# Altium schematic sheet USB_TypeC_DRP.SchDoc: USB Type-C DRP
size A3; DocumentNumber: 13; Revision: A-01; SheetNumber: 13; SheetTotal: 17; Project: STM32MP15-BATTERY BOARD
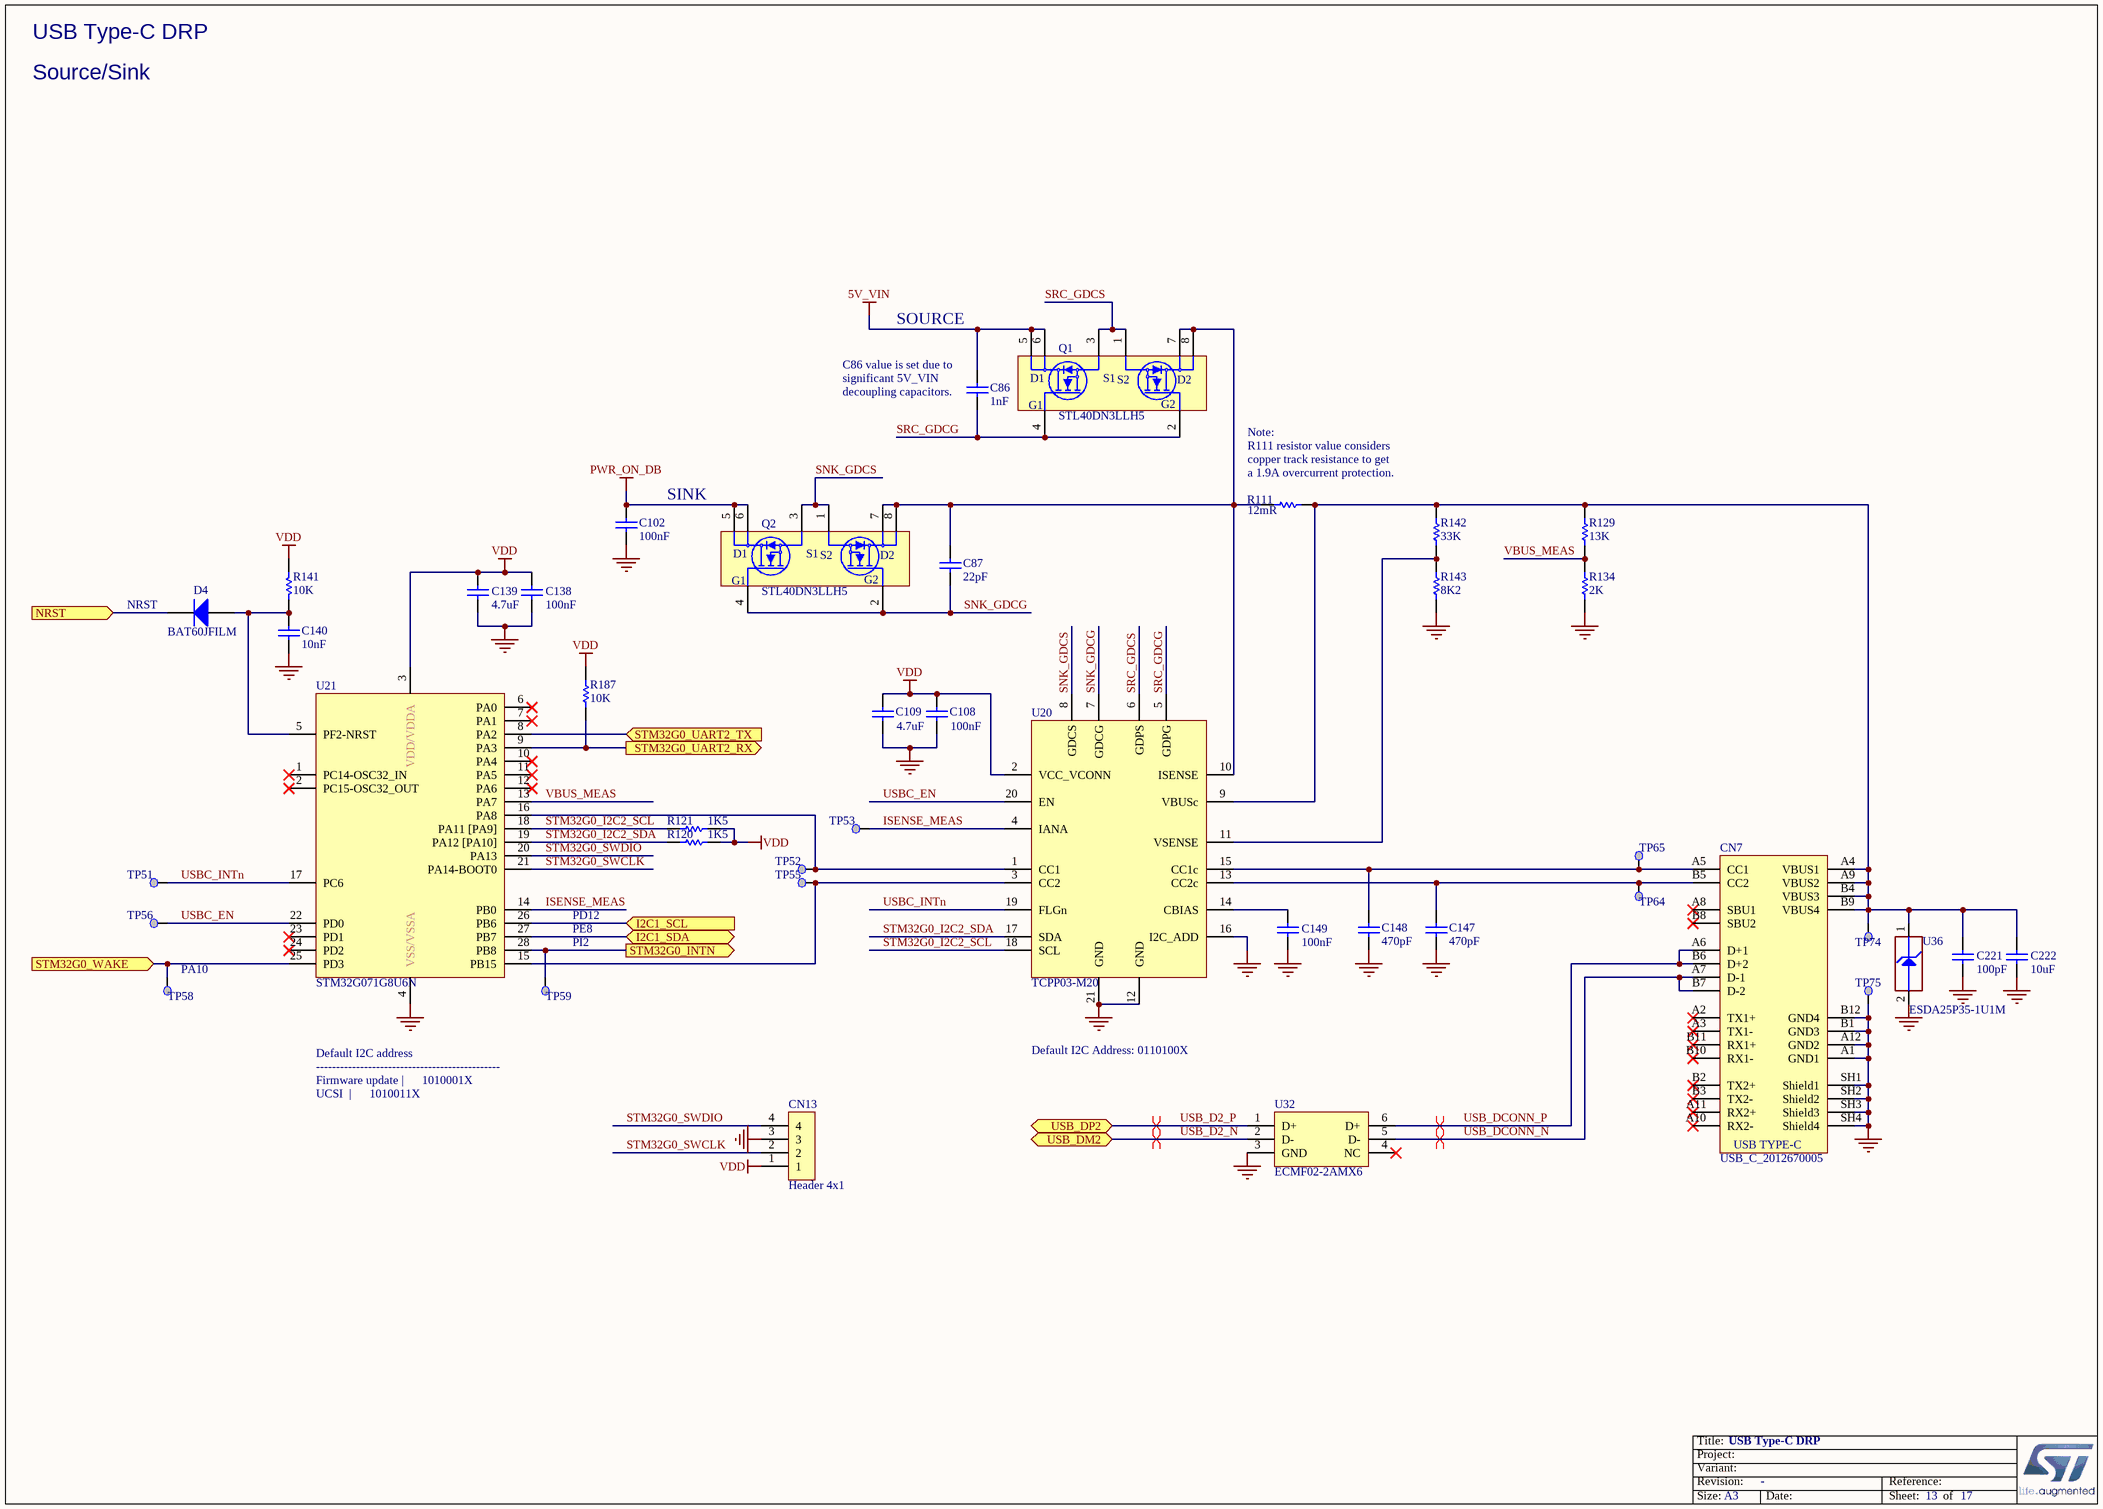
[diagram p0: USB_TypeC_DRP.SchDoc]

## Parts
C86  value 1nF  [C0402]  (hidden comment: Capacitor)
C87  value 22pF  [C0402]  (hidden comment: Capacitor)
C102  value 100nF  [C0402]  (hidden comment: Capacitor)
C108  value 100nF  [C0402]  (hidden comment: Capacitor)
C109  value 4.7uF  [C0402]  (hidden comment: Capacitor)
C138  value 100nF  [C0402]  (hidden comment: Capacitor)
C139  value 4.7uF  [C0402]  (hidden comment: Capacitor)
C140  value 10nF  [C0402]  (hidden comment: Capacitor)
C147  value 470pF  [C0402]  (hidden comment: Capacitor)
C148  value 470pF  [C0402]  (hidden comment: Capacitor)
C149  value 100nF  [C0603]  (hidden comment: Capacitor)
C221  value 100pF  [C0402]  (hidden comment: Capacitor)
C222  value 10uF  [C1210]  (hidden comment: Capacitor)
CN7  value USB_C_2012670005  [CON_USB-TYPEC_MOLEX_2012670005]  (hidden comment: USB_TYPE_C_Receptacle)
CN13  Header 4x1  [CON_SAMTEC_TSW-104-07-G-S]
D4  BAT60JFILM  [DIO_SOD323]
Q1  STL40DN3LLH5  [PowerFLAT_5x6]
Q2  STL40DN3LLH5  [PowerFLAT_5x6]
R111  value 12mR  [R0603_H070]  (hidden comment: Resistor)
R120  value 1K5  [R0402]  (hidden comment: Resistor)
R121  value 1K5  [R0402]  (hidden comment: Resistor)
R129  value 13K  [R0603]  (hidden comment: Resistor)
R134  value 2K  [R0603]  (hidden comment: Resistor)
R141  value 10K  [R0402]  (hidden comment: Resistor)
R142  value 33K  [R0603]  (hidden comment: Resistor)
R143  value 8K2  [R0603]  (hidden comment: Resistor)
R187  value 10K  [R0402]  (hidden comment: Resistor)
TP51  Test Point  [TP_SMD_1MM]  (value not drawn)  (no BOM)
TP52  Test Point  [TP_SMD_1MM]  (value not drawn)  (no BOM)
TP53  Test Point  [TP_SMD_1MM]  (value not drawn)  (no BOM)
TP55  Test Point  [TP_SMD_1MM]  (value not drawn)  (no BOM)
TP56  Test Point  [TP_SMD_1MM]  (value not drawn)  (no BOM)
TP58  Test Point  [TP_SMD_1MM]  (value not drawn)  (no BOM)
TP59  Test Point  [TP_SMD_1MM]  (value not drawn)  (no BOM)
TP64  Test Point  [TP_SMD_1MM]  (value not drawn)  (no BOM)
TP65  Test Point  [TP_SMD_1MM]  (value not drawn)  (no BOM)
TP74  Test Point  [TP_SMD_1MM]  (value not drawn)  (no BOM)
TP75  Test Point  [TP_SMD_1MM]  (value not drawn)  (no BOM)
U20  TCPP03-M20  [ICC_QFN20-EPAD_4X4_P050]
U21  STM32G071G8U6N  [ICC_UFQFPN28_4X4_P050]
U32  ECMF02-2AMX6  [ESD_QFN-6L_1P7X1P5_P050]
U36  value ESDA25P35-1U1M  [ESD_QFN1610_2N_1K_2A]  (hidden comment: ESD-TRANSIL)

## Ports
I2C1_SCL (in), I2C1_SDA (bidir), NRST (in), STM32G0_INTN (out), STM32G0_UART2_RX (out), STM32G0_UART2_TX (in), STM32G0_WAKE (in), USB_DM2 (bidir), USB_DP2 (bidir)

## Nets
5V_VIN: C86.2 Q1.5(D1) Q1.6(D1)
GND: C102.1 C108.1 C109.1 C138.1 C139.1 C140.1 C147.1 C148.1 C149.1 C221.1 C222.1 CN7.A1(GND1) CN7.A12(GND2) CN7.B1(GND3) CN7.B12(GND4) CN7.SH1(Shield1) CN7.SH2(Shield2) CN7.SH3(Shield3) CN7.SH4(Shield4) CN13.3 R134.1 R143.1 TP75.1 U20.12(GND) U20.16(I2C_ADD) U20.21(GND) U21.4(VSS/VSSA) U32.3(GND) U36.2(GND)
PWR_ON_DB: C102.2 Q2.5(D1) Q2.6(D1)
VDD: C108.2 C109.2 C138.2 C139.2 CN13.1 R120.2 R121.1 R141.2 R187.2 U20.2(VCC_VCONN) U21.3(VDD/VDDA)
I2C1_SCL: U21.26(PB6) ; port I2C1_SCL
I2C1_SDA: U21.27(PB7) ; port I2C1_SDA
ISENSE_MEAS: TP53.1 U20.4(IANA) U21.14(PB0)
NRST: D4.2(K) ; port NRST
SNK_GDCG: C87.1 Q2.2(G2) Q2.4(G1) U20.7(GDCG)
SNK_GDCS: Q2.1(S2) Q2.3(S1) U20.8(GDCS)
SRC_GDCG: C86.1 Q1.2(G2) Q1.4(G1) U20.5(GDPG)
SRC_GDCS: Q1.1(S2) Q1.3(S1) U20.6(GDPS)
STM32G0_I2C2_SCL: R121.2 U20.18(SCL) U21.18(PA11_[PA9])
STM32G0_I2C2_SDA: R120.1 U20.17(SDA) U21.19(PA12_[PA10])
STM32G0_INTN: TP59.1 U21.28(PB8) ; port STM32G0_INTN
STM32G0_SWCLK: CN13.2 U21.21(PA14-BOOT0)
STM32G0_SWDIO: CN13.4 U21.20(PA13)
STM32G0_UART2_RX: R187.1 U21.9(PA3) ; port STM32G0_UART2_RX
STM32G0_UART2_TX: U21.8(PA2) ; port STM32G0_UART2_TX
STM32G0_WAKE: TP58.1 U21.25(PD3) ; port STM32G0_WAKE
USB_D2_N: U32.2(D-) ; port USB_DM2
USB_D2_P: U32.1(D+) ; port USB_DP2
USB_DCONN_N: CN7.A7(D-1) CN7.B7(D-2) U32.5(D-)
USB_DCONN_P: CN7.A6(D+1) CN7.B6(D+2) U32.6(D+)
USBC_EN: TP56.1 U20.20(EN) U21.22(PD0)
USBC_INTn: TP51.1 U20.19(FLGn) U21.17(PC6)
VBUS_MEAS: R129.1 R134.2 U21.13(PA7)
NetC87_2: C87.2 Q1.7(D2) Q1.8(D2) Q2.7(D2) Q2.8(D2) R111.2 U20.10(ISENSE)
NetC140_2: C140.2 D4.1(A) R141.1 U21.5(PF2-NRST)
NetC147_2: C147.2 CN7.B5(CC2) TP64.1 U20.13(CC2c)
NetC148_2: C148.2 CN7.A5(CC1) TP65.1 U20.15(CC1c)
NetC149_2: C149.2 U20.14(CBIAS)
NetC221_2: C221.2 C222.2 CN7.A4(VBUS1) CN7.A9(VBUS2) CN7.B4(VBUS3) CN7.B9(VBUS4) R111.1 R129.2 R142.2 TP74.1 U20.9(VBUSc) U36.1(IO1)
NetR142_1: R142.1 R143.2 U20.11(VSENSE)
NetTP52_1: TP52.1 U20.1(CC1) U21.16(PA8)
NetTP55_1: TP55.1 U20.3(CC2) U21.15(PB15)

Not connected (* = marked no-connect by the designer): CN7 A2(TX1+)* A3(TX1-)* A8(SBU1)* A10(RX2-)* A11(RX2+)* B2(TX2+)* B3(TX2-)* B8(SBU2)* B10(RX1-)* B11(RX1+)*; U21 1(PC14-OSC32_IN)* 2(PC15-OSC32_OUT)* 6(PA0)* 7(PA1)* 10(PA4)* 11(PA5)* 12(PA6)* 23(PD1)* 24(PD2)*; U32 4(NC)*

## Layout directives
differential pair: USB_D2_N, USB_D2_P, USB_DCONN_N, USB_DCONN_P

## Notes on the sheet
- USB Type-C DRP
- Source/Sink
- SOURCE
- (near C86) C86 value is set due to significant 5V_VIN decoupling capacitors.
- SINK
- (near R111) Note:
  R111 resistor value considers copper track resistance to get a 1.9A overcurrent protection.
- (near D4) NRST
- PD12
- (near TP58) PA10
- PE8
- PI2
- Default I2C Address: 0110100X
- Default I2C address
  ----------------------------------------------
  Firmware update	|      1010001X
  UCSI		|      1010011X
- Title:
- Project:
- Size:
- Revision:
- Variant:
- A3
- -
- Date:
- Reference:
- Sheet:
- of
- (in symbol MCD-02421) USB TYPE-C

## Library data of the parts
C86 = MCD-00198: Capacitor, MLCC, 1nF, 16V, X7R, +/-10%, 0402, T=0.5mm; Part_Preference: Recommended; Manufacturer: YAGEO; Manufacturer_Part_Number: CC0402KRX7R7BB102; Component_Country_Of_Origin: China; ShowFields: YES; ID: 2665; Internal_Part_Number: MCD-00198; Status: Released; Part_Type: Capacitor; Package: 0402; ComponentLink1URL: http://tunmcdsvn.tun.st.com/Component_Documentation_Library/Trunk/Capacitor/YAGEO_X7R_Series; Order_Code_Digikey: 311-1352-1-ND; Order_Code_Farnell: 2370642; Order_Code_RS: N/A
C87 = MCD-01995: Capacitor, MLCC, 22pF, 50V, C0G, +/-5%, 0402, T=0.5mm; Part_Preference: Recommended; Manufacturer: TDK; Manufacturer_Part_Number: C1005NP01H220J050BA; Component_Country_Of_Origin: Unknown; ShowFields: YES; ID: 4095; Internal_Part_Number: MCD-01995; Status: Released; Part_Type: Capacitor; Package: 0402; ComponentLink1URL: http://tunmcdsvn.tun.st.com/Component_Documentation_Library/Trunk/Capacitor/TDK_C_Series; Order_Code_Digikey: 445-13793-1-ND; Order_Code_Farnell: 3416050RL; Order_Code_RS: N/A
C102 C108 C138 = MCD-00006: Capacitor, MLCC, 100nF, 16V, X7R, +/-10%, 0402, T=0.5mm; Part_Preference: Recommended; Manufacturer: YAGEO; Manufacturer_Part_Number: CC0402KRX7R7BB104; Order_Code_RS: 616-9701; Component_Country_Of_Origin: China; ShowFields: YES; ID: 2474; Internal_Part_Number: MCD-00006; Status: Released; Part_Type: Capacitor; Package: 0402; ComponentLink1URL: http://tunmcdsvn.tun.st.com/Component_Documentation_Library/Trunk/Capacitor/YAGEO_X7R_Series; Order_Code_Digikey: 311-1338-1-ND; Order_Code_Farnell: 9402047
C109 C139 = MCD-01356: Capacitor, MLCC, 4.7uF, 6V3, X5R, +/-20%, 0402, T=0.5mm; Part_Preference: Recommended; Manufacturer: MURATA; Manufacturer_Part_Number: GRM155R60J475ME47; Order_Code_RS: 814-5230; Component_Country_Of_Origin: Japan; ShowFields: YES; ID: 3456; Internal_Part_Number: MCD-01356; Status: Released; Part_Type: Capacitor; Package: 0402; ComponentLink1URL: http://tunmcdsvn.tun.st.com/Component_Documentation_Library/Trunk/Capacitor/MURATA_GRM_Series; Order_Code_Digikey: 490-5915-1-ND; Order_Code_Farnell: 2666407
C140 = MCD-02198: Capacitor, MLCC, 10nF, 50V, X7R, +/-10%, 0402, T=0.5mm; Part_Preference: Recommended; Manufacturer: YAGEO; Manufacturer_Part_Number: CC0402KRX7R9BB103; Order_Code_RS: 6169644; Component_Country_Of_Origin: China; ShowFields: YES; ID: 4298; Internal_Part_Number: MCD-02198; Status: Checked; Part_Type: Capacitor; Package: 0402; ComponentLink1URL: http://tunmcdsvn.tun.st.com/Component_Documentation_Library/Trunk/Capacitor/YAGEO_X7R_Series; Order_Code_Digikey: N/A; Order_Code_Farnell: N/A
C147 C148 = MCD-00724: Capacitor, MLCC, 470pF, 50V, NPO, +/-5%, 0402, T=0.5mm; Manufacturer_Part_Number: CC0402JRNPO9BN471; Manufacturer: YAGEO; Part_Preference: Recommended; Order_Code_RS: 199-2186; Component_Country_Of_Origin: China; ShowFields: YES; ID: 3023; Internal_Part_Number: MCD-00724; Status: Released; Part_Type: Capacitor; Package: 0402; ComponentLink1URL: http://tunmcdsvn.tun.st.com/Component_Documentation_Library/Trunk/Capacitor/YAGEO_NP0_Series; Order_Code_Digikey: 311-1671-1-ND; Order_Code_Farnell: 3366416
C149 = MCD-01099: Capacitor, MLCC, 100nF, 50V, X7R, +/-10%, 0603, T=0.8mm; BMS_Part_Number: 9142278; Part_Preference: Recommended; Manufacturer: YAGEO; Manufacturer_Part_Number: CC0603KRX7R9BB104; Order_Code_RS: 669-8767; Component_Country_Of_Origin: China; ShowFields: YES; ID: 3397; Internal_Part_Number: MCD-01099; Status: Released; Part_Type: Capacitor; Package: 0603; ComponentLink1URL: http://tunmcdsvn.tun.st.com/Component_Documentation_Library/Trunk/Capacitor/YAGEO_X7R_Series; Order_Code_Digikey: 311-1344-1-ND; Order_Code_Farnell: 1362556
C221 = MCD-00205: Capacitor, MLCC, 100pF, 50V, NPO, +/-5%, 0402, T=0.5mm; Manufacturer_Part_Number: CC0402JRNPO9BN101; Manufacturer: YAGEO; Part_Preference: Recommended; Component_Country_Of_Origin: China; ShowFields: YES; ID: 2658; Internal_Part_Number: MCD-00205; Status: Released; Part_Type: Capacitor; Package: 0402; ComponentLink1URL: http://tunmcdsvn.tun.st.com/Component_Documentation_Library/Trunk/Capacitor/YAGEO_NP0_Series; Order_Code_Digikey: 311-1024-1-ND; Order_Code_Farnell: 3019226RL; Order_Code_RS: N/A
C222 = MCD-02378: Capacitor, MLCC, 10uF, 50V, X7R, +/-10%, 1210, T=2.5mm; Manufacturer_Part_Number: C3225X7R1H106K250AC; Manufacturer: TDK; Part_Preference: Recommended; Component_Country_Of_Origin: Japan; ShowFields: YES; ID: 4484; Internal_Part_Number: MCD-02378; Status: Checked; Part_Type: Capacitor; Package: 1210; ComponentLink1URL: http://tunmcdsvn.tun.st.com/Component_Documentation_Library/Trunk/Capacitor/TDK_C_Series/; Order_Code_Digikey: 445-C3225X7R1H106K250ACTR-ND; Order_Code_Farnell: 3416257; Order_Code_RS: N/A
CN7 = MCD-02421: USB_TypeC, 24 pins, RA, SMD, T=3.71mm (USB Certified 3.1); Part_Type: Connector; Manufacturer_Part_Number: 2012670005; Manufacturer: MOLEX; Part_Preference: Recommended; Order_Code_RS: 176-8434; Component_Country_Of_Origin: Unknown; ShowFields: YES; ID: 4527; Internal_Part_Number: MCD-02421; Status: Released; ComponentLink1URL: http://tunmcdsvn.tun.st.com/Component_Documentation_Library/Trunk/Connector/MOLEX_201267_Series; Order_Code_Digikey: WM17992TR-ND; Order_Code_Farnell: 2990523
CN13 = MCD-00029: Header, 4x1, 2.54mm, VR, TH, T=5.84mm/2.54mm; Part_Type: Connector; Manufacturer_Part_Number: TSW-104-07-G-S; Manufacturer: SAMTEC; Part_Preference: Recommended; Order_Code_RS: 161-2261; Component_Country_Of_Origin: China, Costa Rica, Malaysia, United States, Vietnam; ShowFields: YES; ID: 2487; Internal_Part_Number: MCD-00029; Value: Header 4x1; Status: Released; ComponentLink1URL: http://tunmcdsvn.tun.st.com/Component_Documentation_Library/Trunk/Connector/SAMTEC_TSW_Series/; Order_Code_Digikey: TSW-104-07-G-S-ND; Order_Code_Farnell: 2667450
D4 = MCD-00034: BMS_Part_Number: 9151097; Part_Preference: Recommended; Part_Type: Diode; Manufacturer: STMICROELECTRONICS; Manufacturer_HQ_COO: EU; Component_Country_Of_Origin: China; ShowFields: YES; ID: 2483; Internal_Part_Number: MCD-00034; Value: BAT60JFILM; Status: Released; Manufacturer_Part_Number: BAT60JFILM; ComponentLink1URL: http://tunmcdsvn.tun.st.com/Component_Datasheet_Library/Trunk/Diodes/STM_Diode_BAT60JFILM-SOD323
Q1 Q2 = MCD-02152: MOSFET, Dual N-channel 30 V, 0.016 Ω typ., 40 A, STripFET™ H5 Power MOSFET; Part_Preference: Recommended; Part_Type: Transistor; Manufacturer: STMICROELECTRONICS; Manufacturer_HQ_COO: EU; Component_Country_Of_Origin: China; ShowFields: YES; ID: 4252; Internal_Part_Number: MCD-02152; Value: STL40DN3LLH5; Status: Released; Manufacturer_Part_Number: STL40DN3LLH5; Package: PowerFLAT 5x6; ComponentLink1URL: http://tunmcdsvn.tun.st.com/Component_Datasheet_Library/Trunk/Transistors/STMICROELECTRONICS_STL40DN3LLH5; Order_Code_Digikey: N/A; Order_Code_Farnell: N/A; Order_Code_RS: N/A
R111 = MCD-03129: Resistor, 12mR, 0603, +/-1%, 1/2W; Part_Preference: Recommended; Manufacturer: VISHAY; Manufacturer_Part_Number: WFCP0603R0120FE66; ShowFields: YES; ID: 5245; Component_Country_Of_Origin: Taiwan°; Internal_Part_Number: MCD-03129; Status: New; Part_Type: Resistor; ComponentLink1URL: http://tunmcdsvn.tun.st.com/Component_Documentation_Library/Trunk/Resistor/VISHAY_WFCP_Series; Order_Code_Digikey: 541-WFCP0603R0120FE66TR-ND; Order_Code_Farnell: 3954016RL; Order_Code_RS: N/A; Package: 0603
R120 R121 = MCD-00068: Resistor, 1K5, 0402, +/-1%, 1/16W; Part_Preference: Recommended; Manufacturer: YAGEO; Manufacturer_Part_Number: RC0402FR-071K5L; Component_Country_Of_Origin: China; ShowFields: YES; ID: 2524; Internal_Part_Number: MCD-00068; Status: Released; Part_Type: Resistor; Package: 0402; ComponentLink1URL: http://tunmcdsvn.tun.st.com/Component_Documentation_Library/Trunk/Resistor/YAGEO_RC_L_Series; Order_Code_Digikey: 311-1.50KLRCT-ND; Order_Code_Farnell: 9239251; Order_Code_RS: N/A
R129 = MCD-00384: Resistor, 13K, 0603,+/-1%, 1/10W; Part_Preference: Recommended; Manufacturer: YAGEO; Manufacturer_Part_Number: RC0603FR-0713KL; Component_Country_Of_Origin: China; ShowFields: YES; ID: 2894; Internal_Part_Number: MCD-00384; Status: Released; Part_Type: Resistor; Package: 0603; ComponentLink1URL: http://tunmcdsvn.tun.st.com/Component_Documentation_Library/Trunk/Resistor/YAGEO_RC_L_Series; Order_Code_Digikey: 311-13.0KHRCT-ND; Order_Code_Farnell: 1799325; Order_Code_RS: N/A
R134 = MCD-00420: Resistor, 2K ,0603, +/-1%, 1/10W; Part_Preference: Recommended; Manufacturer: YAGEO; Manufacturer_Part_Number: RC0603FR-072KL; Component_Country_Of_Origin: China; ShowFields: YES; ID: 2857; Internal_Part_Number: MCD-00420; Status: Released; Part_Type: Resistor; Package: 0603; ComponentLink1URL: http://tunmcdsvn.tun.st.com/Component_Documentation_Library/Trunk/Resistor/YAGEO_RC_L_Series; Order_Code_Digikey: 311-2.00KHRCT-ND; Order_Code_Farnell: 1799328; Order_Code_RS: N/A
R141 = MCD-00053: Resistor, 10K, 0402, +/-1%, 1/16W; BMS_Part_Number: 9131590; Part_Preference: Recommended; Manufacturer: YAGEO; Manufacturer_Part_Number: RC0402FR-0710KL; Component_Country_Of_Origin: China; ShowFields: YES; ID: 2539; Internal_Part_Number: MCD-00053; Status: Released; Part_Type: Resistor; Package: 0402; ComponentLink1URL: http://tunmcdsvn.tun.st.com/Component_Documentation_Library/Trunk/Resistor/YAGEO_RC_L_Series; Order_Code_Digikey: 311-10.0KLRCT-ND; Order_Code_Farnell: 9239359; Order_Code_RS: N/A
R142 = MCD-00259: Resistor, 33K, 0603, +/-1%, 1/10W; BMS_Part_Number: 9129771; Part_Preference: Recommended; Manufacturer: YAGEO; Manufacturer_Part_Number: RC0603FR-0733KL; Component_Country_Of_Origin: China; ShowFields: YES; ID: 2610; Internal_Part_Number: MCD-00259; Status: Released; Part_Type: Resistor; Package: 0603; ComponentLink1URL: http://tunmcdsvn.tun.st.com/Component_Documentation_Library/Trunk/Resistor/YAGEO_RC_L_Series; Order_Code_Digikey: 311-33.0KHRCT-ND; Order_Code_Farnell: 9238662; Order_Code_RS: N/A
R143 = MCD-00530: Resistor, 8K2, 0603, +/-1%, 1/10W; Part_Preference: Recommended; Manufacturer: YAGEO; Manufacturer_Part_Number: RC0603FR-078K2L; Component_Country_Of_Origin: China; ShowFields: YES; ID: 3212; Internal_Part_Number: MCD-00530; Status: Released; Part_Type: Resistor; Package: 0603; ComponentLink1URL: http://tunmcdsvn.tun.st.com/Component_Documentation_Library/Trunk/Resistor/YAGEO_RC_L_Series; Order_Code_Digikey: 311-8.20KHRCT-ND; Order_Code_Farnell: 9238590; Order_Code_RS: N/A
R187 = MCD-00053: Resistor, 10K, 0402, +/-1%, 1/16W; Manufacturer_Part_Number: RC0402FR-0710KL; Manufacturer: YAGEO; BMS_Part_Number: 9131590; Part_Preference: Recommended; Component_Country_Of_Origin: China; ShowFields: YES; ID: 2539; Internal_Part_Number: MCD-00053; Status: Released; Part_Type: Resistor; Package: 0402; ComponentLink1URL: http://tunmcdsvn.tun.st.com/Component_Documentation_Library/Trunk/Resistor/YAGEO_RC_L_Series; Order_Code_Digikey: 311-10.0KLRCT-ND; Order_Code_Farnell: 9239359; Order_Code_RS: N/A
TP51-TP53 TP55 TP56 TP58 TP59 TP64 TP65 TP74 TP75 = MCD-00074: Test Point 1mm; Part_Type: Misc; Part_Preference: Recommended; ShowFields: YES; ID: 2518; Internal_Part_Number: MCD-00074; Status: Released; Manufacturer_Part_Number: N/A; Manufacturer: N/A; ComponentLink1URL: http://na; Order_Code_Digikey: N/A; Order_Code_Farnell: N/A; Order_Code_RS: N/A
U20 = MCD-02130: USB Type-C Port Protection for USB DRP Power Delivery, PPS compliant; Part_Preference: Recommended; Part_Type: IC; Manufacturer: STMICROELECTRONICS; Manufacturer_HQ_COO: EU; Component_Country_Of_Origin: Unknown; ShowFields: YES; ID: 4230; Internal_Part_Number: MCD-02130; Value: TCPP03-M20; Status: Released; Manufacturer_Part_Number: TCPP03-M20; Package: QFN-20L; ComponentLink1URL: http://tunmcdsvn.tun.st.com/Component_Documentation_Library/Trunk/IC/STMICROELECTRONICS_TCPP03-M20; Order_Code_Digikey: N/A; Order_Code_Farnell: N/A; Order_Code_RS: N/A
U21 = MCD-02218: Arm Cortex-M0+ 32-bit MCU, up to 128 KB Flash, 36 KB RAM,  4x USART, timers, ADC, DAC, comm. I/Fs, 1.7-3.6V; Part_Preference: Recommended; Part_Type: IC; Manufacturer: STMICROELECTRONICS; Manufacturer_HQ_COO: EU; Order_Code_RS: NA; Component_Country_Of_Origin: China; ShowFields: YES; ID: 4318; Status: Checked; ComponentLink1URL: http://tunmcdsvn.tun.st.com/Component_Datasheet_Library/Trunk/IC/STM_MCU_STM32G071G8U6N; Internal_Part_Number: MCD-02218; Manufacturer_Part_Number: STM32G071G8U6N; Package: UFQFPN28; Order_Code_Digikey: STM32G071G8U6N-ND; Order_Code_Farnell: 3011626; Value: STM32G071G8U6N
U32 = MCD-00649: Common mode filter with ESD protection for USB 2.0 interface; Part_Type: Diode; Manufacturer: STMICROELECTRONICS; BMS_Part_Number: 9151138; Part_Preference: Recommended; Manufacturer_HQ_COO: EU; Component_Country_Of_Origin: China; ShowFields: YES; ID: 3094; Internal_Part_Number: MCD-00649; Value: ECMF02-2AMX6; Status: Released; Manufacturer_Part_Number: ECMF02-2AMX6; ComponentLink1URL: http://tunmcdsvn.tun.st.com/Component_Datasheet_Library/Trunk/Diodes/STM_ESD_ECMF02-2AMX6
U36 = MCD-01207: High power Transient voltage suppressor:25V/35A EOS and ESD transients protection.; Part_Type: Diode; Manufacturer: STMICROELECTRONICS; Part_Preference: Recommended; Manufacturer_HQ_COO: EU; BMS_Part_Number: 9179045; Component_Country_Of_Origin: China; ShowFields: YES; ID: 3289; Internal_Part_Number: MCD-01207; Status: Released; Manufacturer_Part_Number: ESDA25P35-1U1M; Package: QFN1610; ComponentLink1URL: http://tunmcdsvn.tun.st.com/Component_Datasheet_Library/Trunk/Diodes/STM_ESD_ESDA25P35-1U1M